# Altium project Pi Zero Avionics Rev3.PrjPCB (part 2 of 2)

## Sheet Squibs.SchDoc: Single Squib Connection
size 203 x 127 mm; DrawnBy: Kace Chandler; DocumentNumber: 10; SheetNumber: 10; SheetTotal: 23
Used 3 times, as channels Squib_Managment/Main_Squib, Squib_Managment/Sep_Squib, Squib_Managment/Motor_Squib. Parts and nets are listed once, with the designators drawn on the sheet.
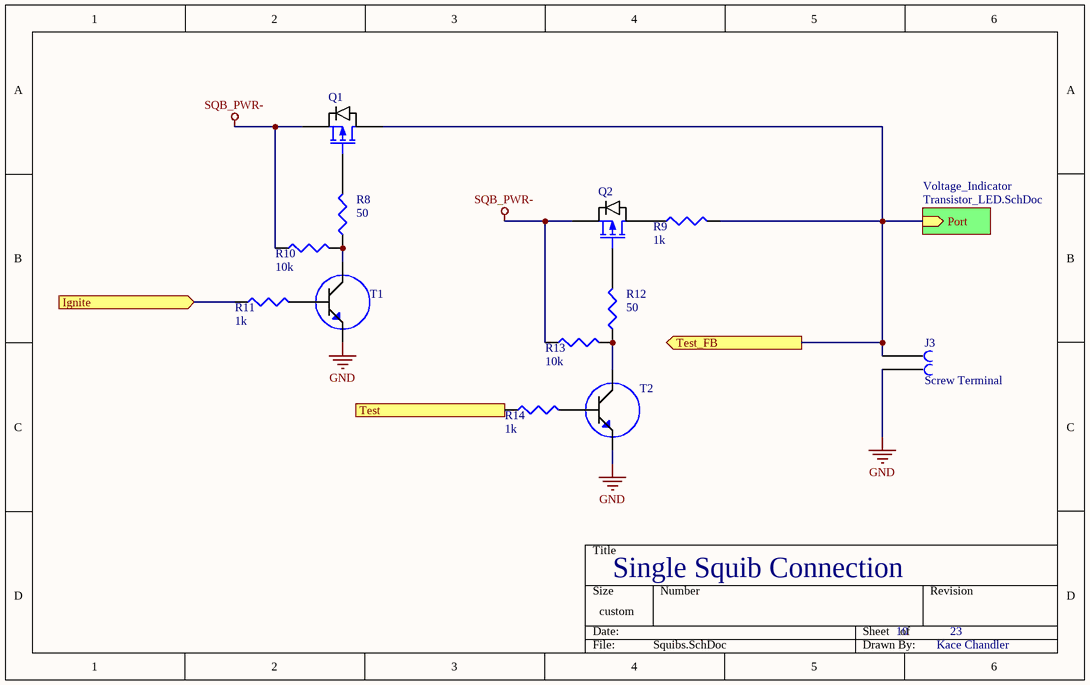
[diagram p18: Squibs.SchDoc]

### Parts
J3  Screw Terminal  [Screw Terminal]
Q1  P-Channel  [P Channel MOSFET]  (value not drawn)
Q2  P-Channel  [P Channel MOSFET]  (value not drawn)
R8  value 50  (hidden comment: Res3)
R9  value 1k  (hidden comment: Res3)
R10  value 10k  (hidden comment: Res3)
R11  value 1k  (hidden comment: Res3)
R12  value 50  (hidden comment: Res3)
R13  value 10k  (hidden comment: Res3)
R14  value 1k  (hidden comment: Res3)
T1  MMBT2222ALT1  [BJT]  (value not drawn)
T2  MMBT2222ALT1  [BJT]  (value not drawn)

### Sub-sheets
Voltage_Indicator = Transistor_LED.SchDoc: Port (in)

### Ports
Ignite (in), Test (in), Test_FB (out)

### Nets
GND: J3.2 T1.2(E) T2.2(E)
SQB_PWR-: Q1.2(S) Q2.2(S) R10.1 R13.1
Ignite: R11.1 ; port Ignite
Test: R14.1 ; port Test
Test_FB: J3.1 Q1.3(D) R9.2 ; port Test_FB, sheet Voltage_Indicator/Port
NetQ1_1: Q1.1(G) R8.2
NetQ2_1: Q2.1(G) R12.2
NetQ2_3: Q2.3(D) R9.1
NetR8_1: R8.1 R10.2 T1.3(C)
NetR11_2: R11.2 T1.1(B)
NetR12_1: R12.1 R13.2 T2.3(C)
NetR14_2: R14.2 T2.1(B)

### Channels
Squib_Managment/Main_Squib: designators end in _Main_Squib; ports Ignite=NetJ15_35 Test=NetJ15_31 Test_FB=NetJ3_Main_Squib_1
Squib_Managment/Sep_Squib: designators end in _Sep_Squib; ports Ignite=NetJ15_36 Test=NetJ15_32 Test_FB=NetJ3_Sep_Squib_1
Squib_Managment/Motor_Squib: designators end in _Motor_Squib; ports Ignite=NetJ15_37 Test=NetJ15_29 Test_FB=NetJ3_Motor_Squib_1

### Library data of the parts
R8-R14 = Res3: Resistor; Published: 8-Jun-2000; LatestRevisionDate: 29-May-2009; LatestRevisionNote: IPC-7351 Footprint Added.; PackageReference: J1-0603; Publisher: Altium Limited; PackageDescription: Chip Resistor
T1 T2 = BJT NPN: Trans NPN 40V 0.6A SOT23; MF: ON Semiconductor; SnapEDA_Link: https://www.snapeda.com/parts/MMBT2222ALT1/ON%20Semiconductor/view-part/?ref=snap; Price: None; Availability: Unavailable; MP: MMBT2222ALT1; Package: SOT-23 Motorola; Value: *; Supplier 1: Digi-Key; Supplier Part Number 1: MMBT2222ATPMSCT-ND
J3 = Screw Terminal: Supplier 1: Digi-Key; Supplier Part Number 1: A112762-ND
Q1 Q2 = P-Channel: Supplier 1: Digi-Key; Supplier Part Number 1: SI2343CDS-T1-GE3CT-ND

## Sheet Transistor_LED.SchDoc: LED with Transistor
size 203 x 127 mm; Author: Kace Chandler; DrawnBy: Kace Chandler; DocumentNumber: 21; Revision: 1; SheetNumber: 21; SheetTotal: 23
Used 3 times, as channels Squib_Managment/Main_Squib/Voltage_Indicator, Squib_Managment/Sep_Squib/Voltage_Indicator, Squib_Managment/Motor_Squib/Voltage_Indicator. Parts and nets are listed once, with the designators drawn on the sheet.
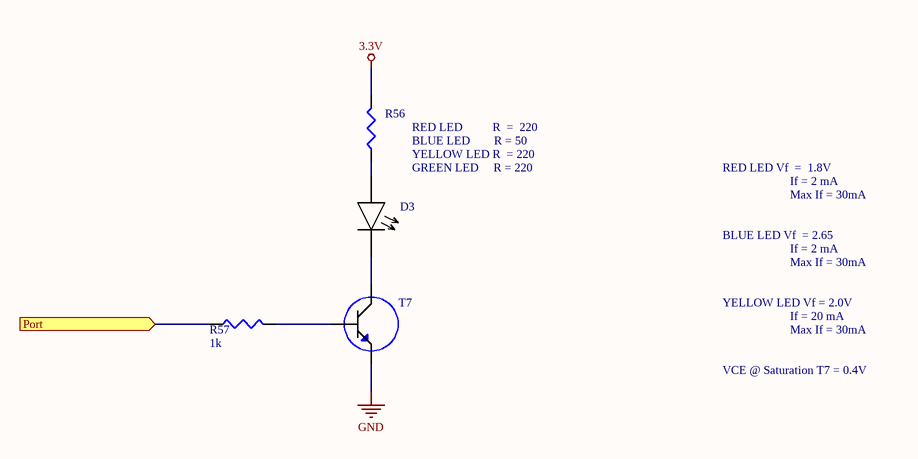
[diagram p19: Transistor_LED.SchDoc]

### Parts
D3  LED_R  [0402 footprint]  (value not drawn)
R56  Res3  (value not drawn)
R57  value 1k  (hidden comment: Res3)
T7  MMBT2222ALT1  [BJT]  (value not drawn)

### Ports
Port (in)

### Nets
3.3V: R56.2
GND: T7.2(E)
Port: R57.1 ; port Port
NetD3_1: D3.1 R56.1
NetD3_2: D3.2 T7.3(C)
NetR57_2: R57.2 T7.1(B)

### Channels
Squib_Managment/Main_Squib/Voltage_Indicator: designators end in _Squib_Managment_Main_Squib_Voltage_Indicator; ports Port=NetJ3_Main_Squib_1
Squib_Managment/Sep_Squib/Voltage_Indicator: designators end in _Squib_Managment_Sep_Squib_Voltage_Indicator; ports Port=NetJ3_Sep_Squib_1
Squib_Managment/Motor_Squib/Voltage_Indicator: designators end in _Squib_Managment_Motor_Squib_Voltage_Indicator; ports Port=NetJ3_Motor_Squib_1

### Notes on the sheet
- (near R56) RED LED          R  =  220
- (near R56) BLUE LED        R = 50
- YELLOW LED R  = 220
- GREEN LED     R = 220
- RED LED Vf  =  1.8V
- If = 2 mA
- Max If = 30mA
- BLUE LED Vf  = 2.65
- YELLOW LED Vf = 2.0V
- If = 20 mA
- VCE @ Saturation T7 = 0.4V

### Library data of the parts
R56 = Res3: Resistor; Value: Depends on the color of the LED; Published: 8-Jun-2000; LatestRevisionDate: 29-May-2009; LatestRevisionNote: IPC-7351 Footprint Added.; PackageReference: J1-0603; Publisher: Altium Limited; PackageDescription: Chip Resistor
R57 = Res3: Resistor; Published: 8-Jun-2000; LatestRevisionDate: 29-May-2009; LatestRevisionNote: IPC-7351 Footprint Added.; PackageReference: J1-0603; Publisher: Altium Limited; PackageDescription: Chip Resistor
T7 = BJT NPN: as T1 on sheet Squibs; SnapEDA_Link: https://www.snapeda.com/parts/MMBT2222ALT1/ON%20Semiconductor/view-part/?ref=snap; Price: None; Availability: Unavailable; MP: MMBT2222ALT1; Package: SOT-23 Motorola; Value: *; Supplier 1: Digi-Key; Supplier Part Number 1: MMBT2222ATPMSCT-ND
D3 = LED_R: Supplier 1: Digi-Key; Supplier Part Number 1: 754-2123-1-ND

## Sheet No_Transistor_LED_INV.SchDoc: Inverted LED
size 203 x 127 mm; DrawnBy: Kace Chandler; DocumentNumber: 22; SheetNumber: 22; SheetTotal: 23
Used 4 times, as channels Main_IND, Motor_IND, Sep_IND, ACT_IND. Parts and nets are listed once, with the designators drawn on the sheet.
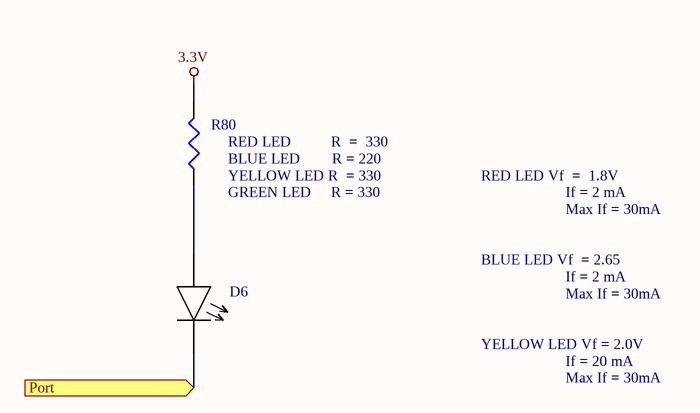
[diagram p20: No_Transistor_LED_INV.SchDoc]

### Parts
D6  LED_R  [0402 footprint]  (value not drawn)
R80  Res3  (value not drawn)

### Ports
Port (in)

### Nets
3.3V: R80.2
Port: D6.2 ; port Port
NetD6_1: D6.1 R80.1

### Channels
Main_IND: designators end in _Main_IND; ports Port=NetD6_Main_IND_2
Motor_IND: designators end in _Motor_IND; ports Port=NetD6_Motor_IND_2
Sep_IND: designators end in _Sep_IND; ports Port=NetD6_Sep_IND_2
ACT_IND: designators end in _ACT_IND; ports Port=NetD1_ERR_IndPi_1

### Notes on the sheet
- (near R80) RED LED          R  =  330
- (near R80) BLUE LED        R = 220
- (near R80) YELLOW LED R  = 330
- (near R80) GREEN LED     R = 330
- RED LED Vf  =  1.8V
- If = 2 mA
- Max If = 30mA
- BLUE LED Vf  = 2.65
- YELLOW LED Vf = 2.0V
- If = 20 mA

### Library data of the parts
R80 = Res3: as R56 on sheet Transistor_LED; Published: 8-Jun-2000; LatestRevisionDate: 29-May-2009; LatestRevisionNote: IPC-7351 Footprint Added.; PackageReference: J1-0603; Publisher: Altium Limited; PackageDescription: Chip Resistor
D6 = LED_R: Supplier 1: Digi-Key; Supplier Part Number 1: 754-2123-1-ND

## Sheet SPI Output.SchDoc: SPI Output
size 203 x 127 mm; DrawnBy: Kace Chandler; DocumentNumber: 19; SheetNumber: 19; SheetTotal: 23
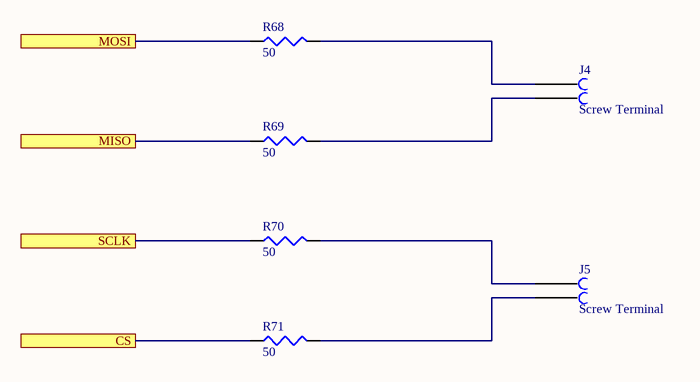
[diagram p21: SPI Output.SchDoc]

### Parts
J4  Screw Terminal  [Screw Terminal]
J5  Screw Terminal  [Screw Terminal]
R68  value 50  [0603 Footprint]  (hidden comment: Res3)
R69  value 50  [0603 Footprint]  (hidden comment: Res3)
R70  value 50  [0603 Footprint]  (hidden comment: Res3)
R71  value 50  [0603 Footprint]  (hidden comment: Res3)

### Ports
CS, MISO, MOSI, SCLK

### Nets
MISO: R69.1 ; port MISO
MOSI: R68.1 ; port MOSI
SCL: R70.1 ; port SCLK
NetJ4_1: J4.1 R68.2
NetJ4_2: J4.2 R69.2
NetJ5_1: J5.1 R70.2
NetJ5_2: J5.2 R71.2
NetR71_1: R71.1 ; port CS

### Library data of the parts
R68-R71 = Res3: Resistor; Published: 8-Jun-2000; LatestRevisionDate: 29-May-2009; LatestRevisionNote: IPC-7351 Footprint Added.; PackageReference: J1-0603; Publisher: Altium Limited; PackageDescription: Chip Resistor
J4 J5 = Screw Terminal: Supplier 1: Digi-Key; Supplier Part Number 1: A112762-ND

## Sheet UART Output.SchDoc: UART Output
size 203 x 127 mm; DrawnBy: Kace Chandler; DocumentNumber: 20; SheetNumber: 20; SheetTotal: 23
Used 2 times, as channels ESP UART Output, UART EXT. Parts and nets are listed once, with the designators drawn on the sheet.
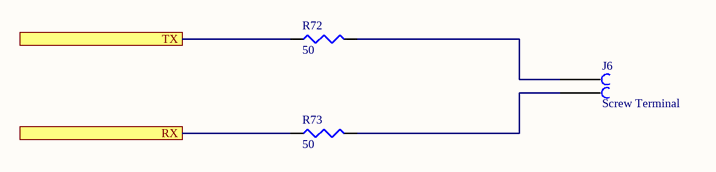
[diagram p22: UART Output.SchDoc]

### Parts
J6  Screw Terminal  [Screw Terminal]
R72  value 50  [0603 Footprint]  (hidden comment: Res3)
R73  value 50  [0603 Footprint]  (hidden comment: Res3)

### Ports
RX, TX

### Nets
RX: R73.1 ; port RX
TX: R72.1 ; port TX
NetJ6_1: J6.1 R72.2
NetJ6_2: J6.2 R73.2

### Channels
ESP UART Output: designators end in _ESP_UART_Output; ports RX=NetR73_ESP_UART_Output_1 TX=NetR72_ESP_UART_Output_1
UART EXT: designators end in _UART_EXT; ports RX=NetR73_UART_EXT_1 TX=NetR72_UART_EXT_1

### Library data of the parts
R72 R73 = Res3: Resistor; Published: 8-Jun-2000; LatestRevisionDate: 29-May-2009; LatestRevisionNote: IPC-7351 Footprint Added.; PackageReference: J1-0603; Publisher: Altium Limited; PackageDescription: Chip Resistor
J6 = Screw Terminal: Supplier 1: Digi-Key; Supplier Part Number 1: A112762-ND

## Sheet EEPROM.SchDoc: Raspberry Pi EEPROM
size 203 x 127 mm; DrawnBy: Kace Chandler
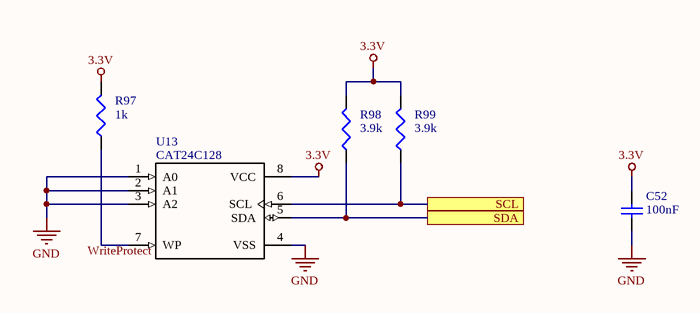
[diagram p23: EEPROM.SchDoc]

### Parts
C52  value 100nF  [0603 to 0805 SMD]  (hidden comment: Cap)
R97  value 1k  [0603 Footprint]  (hidden comment: Res3)
R98  value 3.9k  [0603 Footprint]  (hidden comment: Res3)
R99  value 3.9k  [0603 Footprint]  (hidden comment: Res3)
U13  CAT24C128  [EEPROM]

### Ports
SCL, SDA

### Nets
3.3V: C52.2 R97.2 R98.2 R99.2 U13.8(VCC)
GND: C52.1 U13.1(A0) U13.2(A1) U13.3(A2) U13.4(VSS)
NetJ15_27: R98.1 U13.5(SDA) ; port SDA
NetJ15_28: R99.1 U13.6(SCL) ; port SCL
NetR97_1: R97.1 U13.7(WP)

### Notes on the sheet
- Labels drawn without touching a wire or pin: WriteProtect

### Library data of the parts
R97-R99 = Res3: Resistor; Published: 8-Jun-2000; LatestRevisionDate: 29-May-2009; LatestRevisionNote: IPC-7351 Footprint Added.; PackageReference: J1-0603; Publisher: Altium Limited; PackageDescription: Chip Resistor
U13 = CAT24C128HU4IGT3: EEPROM Serial-I2C 128K-bit 16K x 8 2.5V/3.3V/5V 8-Pin UDFN EP T/R; MF: ON Semiconductor; Package: UFDFN-8 ON Semiconductor; Price: None; MP: CAT24C128HU4IGT3; Availability: Unavailable; SnapEDA_Link: https://www.snapeda.com/parts/CAT24C128HU4IGT3/ON%20Semiconductor/view-part/?ref=snap; Value: *; Supplier 1: Digi-Key; Supplier Part Number 1: CAT24C128HU4IGT3OSDKR-ND

## Nets that join several sheets
3.3V: ESP32 backup (R42.2), Accelerometer (C1.2 C2.2 U1.1 U1.14), Barometer (C11.2 C12.2 U3.1 U3.10), Gyroscope (6 pins), Magnetometer (C17.2 C18.2 U5.8 U5.15), Sensor Array/ADC 1 (C7_ADC_1.2 R6_ADC_1.2 U2_ADC_1.13), Sensor Array/ADC 1/AIN2 (R52_Sensor_Array_ADC_1_AIN2.1), Sensor Array/ADC 1/AIN3 (R52_Sensor_Array_ADC_1_AIN3.1), Sensor Array/ADC 1/AIN0 (R52_Sensor_Array_ADC_1_AIN0.1), Sensor Array/ADC 1/AIN1 (R52_Sensor_Array_ADC_1_AIN1.1), Sensor Array/ADC 2 (C7_ADC_2.2 R6_ADC_2.2 U2_ADC_2.13), Sensor Array/ADC 2/AIN2 (R52_Sensor_Array_ADC_2_AIN2.1), Sensor Array/ADC 2/AIN3 (R52_Sensor_Array_ADC_2_AIN3.1), Sensor Array/ADC 2/AIN0 (R52_Sensor_Array_ADC_2_AIN0.1), Sensor Array/ADC 2/AIN1 (R52_Sensor_Array_ADC_2_AIN1.1), Power Managment (JP1.2), Power IO (J7.1 J11.1 J14.1), Regulators (C44.2 C45.2 R83.2 U11.4), ESP32 (R125.2), Squib_Managment (C40.2 R79.2 U9.12), Squib_Managment/Main_Squib/Voltage_Indicator (R56_Squib_Managment_Main_Squib_Voltage_Indicator.2), Squib_Managment/Sep_Squib/Voltage_Indicator (R56_Squib_Managment_Sep_Squib_Voltage_Indicator.2), Squib_Managment/Motor_Squib/Voltage_Indicator (R56_Squib_Managment_Motor_Squib_Voltage_Indicator.2), Main_IND (R80_Main_IND.2), Motor_IND (R80_Motor_IND.2), Sep_IND (R80_Sep_IND.2), ACT_IND (R80_ACT_IND.2), EEPROM (5 pins)
5V: ESP32 backup (R48.2), U_ESP power (D5_U_ESP_power.1 R78_U_ESP_power.1), Main (J15.2 J15.4), Buzzer (LS1.2), Power Managment (D4.1), Power IO (J10.1), Regulators (10 pins), ESP32 (R131.2), ESP/U_ESP power (D5_ESP_U_ESP_power.1 R78_ESP_U_ESP_power.1)
5V_Clean: ESP32 backup (R38.2), Sensor Array/ADC 1 (C8_ADC_1.2 U2_ADC_1.12), Sensor Array/ADC 1/AIN2 (R51_Sensor_Array_ADC_1_AIN2.1), Sensor Array/ADC 1/AIN3 (R51_Sensor_Array_ADC_1_AIN3.1), Sensor Array/ADC 1/AIN0 (R51_Sensor_Array_ADC_1_AIN0.1), Sensor Array/ADC 1/AIN1 (R51_Sensor_Array_ADC_1_AIN1.1), Sensor Array/ADC 2 (C8_ADC_2.2 U2_ADC_2.12), Sensor Array/ADC 2/AIN2 (R51_Sensor_Array_ADC_2_AIN2.1), Sensor Array/ADC 2/AIN3 (R51_Sensor_Array_ADC_2_AIN3.1), Sensor Array/ADC 2/AIN0 (R51_Sensor_Array_ADC_2_AIN0.1), Sensor Array/ADC 2/AIN1 (R51_Sensor_Array_ADC_2_AIN1.1), Power IO (J9.1 J12.1), Regulators (C41.2 C42.2 R81.2 U10.4), ESP32 (R121.2)
ESP_VCC: ESP32 backup (7 pins), Power Managment (C37.2 U8.12), ESP32 (7 pins)
GND: ESP32 backup (28 pins), U_ESP power (T10_U_ESP_power.2 T11_U_ESP_power.2), ACT_IndESP (R7_ACT_IndESP.1), ERR_IndESP (R7_ERR_IndESP.1), Main (8 pins), Buzzer (T3.2 T4.2), Accelerometer (8 pins), Barometer (5 pins), Gyroscope (10 pins), Magnetometer (5 pins), Sensor Array/ADC 1 (8 pins), Sensor Array/ADC 1/AIN2 (C31_Sensor_Array_ADC_1_AIN2.1 R54_Sensor_Array_ADC_1_AIN2.2 R55_Sensor_Array_ADC_1_AIN2.2), Sensor Array/ADC 1/AIN3 (C31_Sensor_Array_ADC_1_AIN3.1 R54_Sensor_Array_ADC_1_AIN3.2 R55_Sensor_Array_ADC_1_AIN3.2), Sensor Array/ADC 1/AIN0 (C31_Sensor_Array_ADC_1_AIN0.1 R54_Sensor_Array_ADC_1_AIN0.2 R55_Sensor_Array_ADC_1_AIN0.2), Sensor Array/ADC 1/AIN1 (C31_Sensor_Array_ADC_1_AIN1.1 R54_Sensor_Array_ADC_1_AIN1.2 R55_Sensor_Array_ADC_1_AIN1.2), Sensor Array/ADC 2 (8 pins), Sensor Array/ADC 2/AIN2 (C31_Sensor_Array_ADC_2_AIN2.1 R54_Sensor_Array_ADC_2_AIN2.2 R55_Sensor_Array_ADC_2_AIN2.2), Sensor Array/ADC 2/AIN3 (C31_Sensor_Array_ADC_2_AIN3.1 R54_Sensor_Array_ADC_2_AIN3.2 R55_Sensor_Array_ADC_2_AIN3.2), Sensor Array/ADC 2/AIN0 (C31_Sensor_Array_ADC_2_AIN0.1 R54_Sensor_Array_ADC_2_AIN0.2 R55_Sensor_Array_ADC_2_AIN0.2), Sensor Array/ADC 2/AIN1 (C31_Sensor_Array_ADC_2_AIN1.1 R54_Sensor_Array_ADC_2_AIN1.2 R55_Sensor_Array_ADC_2_AIN1.2), Power Managment (18 pins), Power IO (7 pins), Regulators (20 pins), ESP32 (28 pins), ESP/U_ESP power (T10_ESP_U_ESP_power.2 T11_ESP_U_ESP_power.2), ESP/ACT_IndESP (R7_ESP_ACT_IndESP.1), ESP/ERR_IndESP (R7_ESP_ERR_IndESP.1), Squib_Managment (7 pins), Squib_Managment/Main_Squib (J3_Main_Squib.2 T1_Main_Squib.2 T2_Main_Squib.2), Squib_Managment/Main_Squib/Voltage_Indicator (T7_Squib_Managment_Main_Squib_Voltage_Indicator.2), Squib_Managment/Sep_Squib (J3_Sep_Squib.2 T1_Sep_Squib.2 T2_Sep_Squib.2), Squib_Managment/Sep_Squib/Voltage_Indicator (T7_Squib_Managment_Sep_Squib_Voltage_Indicator.2), Squib_Managment/Motor_Squib (J3_Motor_Squib.2 T1_Motor_Squib.2 T2_Motor_Squib.2), Squib_Managment/Motor_Squib/Voltage_Indicator (T7_Squib_Managment_Motor_Squib_Voltage_Indicator.2), ERR_IndPi (R7_ERR_IndPi.1), EEPROM (5 pins)
Pi_3.3V: Main (J15.1 J15.17), Power Managment (JP1.1)
SQB_PWR-: Squib_Managment (U9.3), Squib_Managment/Main_Squib (Q1_Main_Squib.2 Q2_Main_Squib.2 R10_Main_Squib.1 R13_Main_Squib.1), Squib_Managment/Sep_Squib (Q1_Sep_Squib.2 Q2_Sep_Squib.2 R10_Sep_Squib.1 R13_Sep_Squib.1), Squib_Managment/Motor_Squib (Q1_Motor_Squib.2 Q2_Motor_Squib.2 R10_Motor_Squib.1 R13_Motor_Squib.1)
VBAT: ESP32 backup (R44.2), Power Managment (Q3.2 R58.2 U8.1), Power IO (J13.1), ESP32 (R127.2)
VBAT_Switched: ESP32 backup (R35.2), Power Managment (5 pins), ESP32 (R118.2), Squib_Managment (U9.1)
Vdigital: U_ESP power (Q5_U_ESP_power.2 R75_U_ESP_power.1 R76_U_ESP_power.2), Power Managment (C33.2 R61.2 U8.3), Regulators (C43.2 C47.2 U10.2 U12.1), ESP/U_ESP power (Q5_ESP_U_ESP_power.2 R75_ESP_U_ESP_power.1 R76_ESP_U_ESP_power.2)
MISO: Main (J15.21), Accelerometer (U1.7), Barometer (U3.5), Gyroscope (U4.4), Magnetometer (U5.6), Sensor Array/ADC 1 (R4_ADC_1.1), Sensor Array/ADC 2 (R4_ADC_2.1), ESP32 (R107.1), SPI Output (R69.1)
MOSI: Main (R94.2), Accelerometer (U1.6), Barometer (U3.4), Gyroscope (U4.3), Magnetometer (U5.5), Sensor Array/ADC 1 (R3_ADC_1.1), Sensor Array/ADC 2 (R3_ADC_2.1), ESP32 (R108.1), SPI Output (R68.1)
NetC3_ADC_1_1: Sensor Array/ADC 1 (C3_ADC_1.1 C4_ADC_1.1 U2_ADC_1.7), Sensor Array/ADC 1/AIN2 (C31_Sensor_Array_ADC_1_AIN2.2 R53_Sensor_Array_ADC_1_AIN2.1 R54_Sensor_Array_ADC_1_AIN2.1)
NetC3_ADC_1_2: Sensor Array/ADC 1 (C3_ADC_1.2 U2_ADC_1.6), Sensor Array/ADC 1/AIN3 (C31_Sensor_Array_ADC_1_AIN3.2 R53_Sensor_Array_ADC_1_AIN3.1 R54_Sensor_Array_ADC_1_AIN3.1)
NetC3_ADC_2_1: Sensor Array/ADC 2 (C3_ADC_2.1 C4_ADC_2.1 U2_ADC_2.7), Sensor Array/ADC 2/AIN2 (C31_Sensor_Array_ADC_2_AIN2.2 R53_Sensor_Array_ADC_2_AIN2.1 R54_Sensor_Array_ADC_2_AIN2.1)
NetC3_ADC_2_2: Sensor Array/ADC 2 (C3_ADC_2.2 U2_ADC_2.6), Sensor Array/ADC 2/AIN3 (C31_Sensor_Array_ADC_2_AIN3.2 R53_Sensor_Array_ADC_2_AIN3.1 R54_Sensor_Array_ADC_2_AIN3.1)
NetC4_ADC_1_2: Sensor Array/ADC 1 (C4_ADC_1.2 C5_ADC_1.2 U2_ADC_1.10), Sensor Array/ADC 1/AIN1 (C31_Sensor_Array_ADC_1_AIN1.2 R53_Sensor_Array_ADC_1_AIN1.1 R54_Sensor_Array_ADC_1_AIN1.1)
NetC4_ADC_2_2: Sensor Array/ADC 2 (C4_ADC_2.2 C5_ADC_2.2 U2_ADC_2.10), Sensor Array/ADC 2/AIN1 (C31_Sensor_Array_ADC_2_AIN1.2 R53_Sensor_Array_ADC_2_AIN1.1 R54_Sensor_Array_ADC_2_AIN1.1)
NetC5_ADC_1_1: Sensor Array/ADC 1 (C5_ADC_1.1 U2_ADC_1.11), Sensor Array/ADC 1/AIN0 (C31_Sensor_Array_ADC_1_AIN0.2 R53_Sensor_Array_ADC_1_AIN0.1 R54_Sensor_Array_ADC_1_AIN0.1)
NetC5_ADC_2_1: Sensor Array/ADC 2 (C5_ADC_2.1 U2_ADC_2.11), Sensor Array/ADC 2/AIN0 (C31_Sensor_Array_ADC_2_AIN0.2 R53_Sensor_Array_ADC_2_AIN0.1 R54_Sensor_Array_ADC_2_AIN0.1)
NetC21_2: ESP32 backup (C21.2 U6.3), U_ESP power (D5_U_ESP_power.2 Q5_U_ESP_power.3)
NetC33_1: Power Managment (8 pins), Regulators (U12.5)
NetC38_2: Power Managment (C38.2 U8.10), ESP32 (U15.4)
NetC39_2: ESP32 (U15.26), Squib_Managment (C39.2 U9.11)
NetC55_2: ESP32 (C55.2 U14.3), ESP/U_ESP power (D5_ESP_U_ESP_power.2 Q5_ESP_U_ESP_power.3)
NetD1_ACT_IndESP_1: ESP32 backup (U7.36), ACT_IndESP (D1_ACT_IndESP.1)
NetD1_ERR_IndESP_1: ESP32 backup (U7.37), ERR_IndESP (D1_ERR_IndESP.1)
NetD1_ERR_IndPi_1: Main (J15.26), ERR_IndPi (D1_ERR_IndPi.1), ACT_IND (D6_ACT_IND.2)
NetD1_ESP_ACT_IndESP_1: ESP32 (U15.36), ESP/ACT_IndESP (D1_ESP_ACT_IndESP.1)
NetD1_ESP_ERR_IndESP_1: ESP32 (U15.37), ESP/ERR_IndESP (D1_ESP_ERR_IndESP.1)
NetD6_Main_IND_2: Main (J15.33), Main_IND (D6_Main_IND.2)
NetD6_Motor_IND_2: Main (J15.38), Motor_IND (D6_Motor_IND.2)
NetD6_Sep_IND_2: Main (J15.40), Sep_IND (D6_Sep_IND.2)
NetJ1_ADC_1_1: Sensor Array/ADC 1 (J1_ADC_1.1), Sensor Array/ADC 1/AIN2 (R51_Sensor_Array_ADC_1_AIN2.2 R52_Sensor_Array_ADC_1_AIN2.2 R53_Sensor_Array_ADC_1_AIN2.2 R55_Sensor_Array_ADC_1_AIN2.1)
NetJ1_ADC_1_2: Sensor Array/ADC 1 (J1_ADC_1.2), Sensor Array/ADC 1/AIN3 (R51_Sensor_Array_ADC_1_AIN3.2 R52_Sensor_Array_ADC_1_AIN3.2 R53_Sensor_Array_ADC_1_AIN3.2 R55_Sensor_Array_ADC_1_AIN3.1)
NetJ1_ADC_2_1: Sensor Array/ADC 2 (J1_ADC_2.1), Sensor Array/ADC 2/AIN2 (R51_Sensor_Array_ADC_2_AIN2.2 R52_Sensor_Array_ADC_2_AIN2.2 R53_Sensor_Array_ADC_2_AIN2.2 R55_Sensor_Array_ADC_2_AIN2.1)
NetJ1_ADC_2_2: Sensor Array/ADC 2 (J1_ADC_2.2), Sensor Array/ADC 2/AIN3 (R51_Sensor_Array_ADC_2_AIN3.2 R52_Sensor_Array_ADC_2_AIN3.2 R53_Sensor_Array_ADC_2_AIN3.2 R55_Sensor_Array_ADC_2_AIN3.1)
NetJ2_ADC_1_1: Sensor Array/ADC 1 (J2_ADC_1.1), Sensor Array/ADC 1/AIN0 (R51_Sensor_Array_ADC_1_AIN0.2 R52_Sensor_Array_ADC_1_AIN0.2 R53_Sensor_Array_ADC_1_AIN0.2 R55_Sensor_Array_ADC_1_AIN0.1)
NetJ2_ADC_1_2: Sensor Array/ADC 1 (J2_ADC_1.2), Sensor Array/ADC 1/AIN1 (R51_Sensor_Array_ADC_1_AIN1.2 R52_Sensor_Array_ADC_1_AIN1.2 R53_Sensor_Array_ADC_1_AIN1.2 R55_Sensor_Array_ADC_1_AIN1.1)
NetJ2_ADC_2_1: Sensor Array/ADC 2 (J2_ADC_2.1), Sensor Array/ADC 2/AIN0 (R51_Sensor_Array_ADC_2_AIN0.2 R52_Sensor_Array_ADC_2_AIN0.2 R53_Sensor_Array_ADC_2_AIN0.2 R55_Sensor_Array_ADC_2_AIN0.1)
NetJ2_ADC_2_2: Sensor Array/ADC 2 (J2_ADC_2.2), Sensor Array/ADC 2/AIN1 (R51_Sensor_Array_ADC_2_AIN1.2 R52_Sensor_Array_ADC_2_AIN1.2 R53_Sensor_Array_ADC_2_AIN1.2 R55_Sensor_Array_ADC_2_AIN1.1)
NetJ3_Main_Squib_1: ESP32 (R102.2), Squib_Managment/Main_Squib (J3_Main_Squib.1 Q1_Main_Squib.3 R9_Main_Squib.2), Squib_Managment/Main_Squib/Voltage_Indicator (R57_Squib_Managment_Main_Squib_Voltage_Indicator.1)
NetJ3_Motor_Squib_1: ESP32 (R112.2), Squib_Managment/Motor_Squib (J3_Motor_Squib.1 Q1_Motor_Squib.3 R9_Motor_Squib.2), Squib_Managment/Motor_Squib/Voltage_Indicator (R57_Squib_Managment_Motor_Squib_Voltage_Indicator.1)
NetJ3_Sep_Squib_1: ESP32 (R106.2), Squib_Managment/Sep_Squib (J3_Sep_Squib.1 Q1_Sep_Squib.3 R9_Sep_Squib.2), Squib_Managment/Sep_Squib/Voltage_Indicator (R57_Squib_Managment_Sep_Squib_Voltage_Indicator.1)
NetJ15_10: Main (J15.10), 3 way uart switch (S1.3)
NetJ15_12: Main (J15.12), Buzzer (R15.1)
NetJ15_16: Main (J15.16), ESP32 (R101.2)
NetJ15_18: Main (J15.18), ESP32 (R117.1)
NetJ15_22: Main (J15.22), ESP32 (R130.2 R132.2)
NetJ15_27: Main (J15.27), EEPROM (R98.1 U13.5)
NetJ15_28: Main (J15.28), EEPROM (R99.1 U13.6)
NetJ15_29: Main (J15.29), Squib_Managment/Motor_Squib (R14_Motor_Squib.1)
NetJ15_31: Main (J15.31), Squib_Managment/Main_Squib (R14_Main_Squib.1)
NetJ15_32: Main (J15.32), Squib_Managment/Sep_Squib (R14_Sep_Squib.1)
NetJ15_35: Main (J15.35), Squib_Managment/Main_Squib (R11_Main_Squib.1)
NetJ15_36: Main (J15.36), Squib_Managment/Sep_Squib (R11_Sep_Squib.1)
NetJ15_37: Main (J15.37), Squib_Managment/Motor_Squib (R11_Motor_Squib.1)
NetR2_ADC_1_1: Main (R92.2), Sensor Array/ADC 1 (R2_ADC_1.1), ESP32 (R104.1)
NetR2_ADC_2_1: Main (R93.2), Sensor Array/ADC 2 (R2_ADC_2.1), ESP32 (R123.2)
NetR16_1: Buzzer (R16.1), ESP32 (U15.19)
NetR64_2: Power Managment (R64.2), ESP32 (U15.18)
NetR67_1: Power Managment (R67.1), ESP32 (U15.17)
NetR71_1: Main (R96.1), ESP32 (R124.2), SPI Output (R71.1)
NetR72_ESP_UART_Output_1: ESP32 (U15.28), ESP UART Output (R72_ESP_UART_Output.1)
NetR72_UART_EXT_1: 3 way uart switch (S1.1 S2.2), UART EXT (R72_UART_EXT.1)
NetR73_ESP_UART_Output_1: ESP32 (U15.27), ESP UART Output (R73_ESP_UART_Output.1)
NetR73_UART_EXT_1: 3 way uart switch (S3.3), UART EXT (R73_UART_EXT.1)
NetR79_1: ESP32 (U15.22), Squib_Managment (R79.1 U9.6)
NetR87_1: Main (R87.1), 3 way uart switch (S2.1 S3.2)
NetR88_2: Main (R88.2), Accelerometer (U1.8), ESP32 (R105.1)
NetR89_2: Main (R89.2), Barometer (U3.6), ESP32 (R111.1)
NetR90_2: Main (R90.2), Gyroscope (U4.5), ESP32 (R114.1)
NetR91_2: Main (R91.2), Magnetometer (U5.2), ESP32 (R116.1)
NetR120_2: ESP32 (R120.2), 3 way uart switch (S1.2 S3.1)
NetS2_3: ESP32 (U15.34), 3 way uart switch (S2.3)
SCL: Main (R95.2), Accelerometer (U1.4), Barometer (U3.2), Gyroscope (U4.2), Magnetometer (U5.3), Sensor Array/ADC 1 (R1_ADC_1.1), Sensor Array/ADC 2 (R1_ADC_2.1), ESP32 (R110.1), SPI Output (R70.1)